# Altium schematic sheet 02_Power.SchDoc
size A4
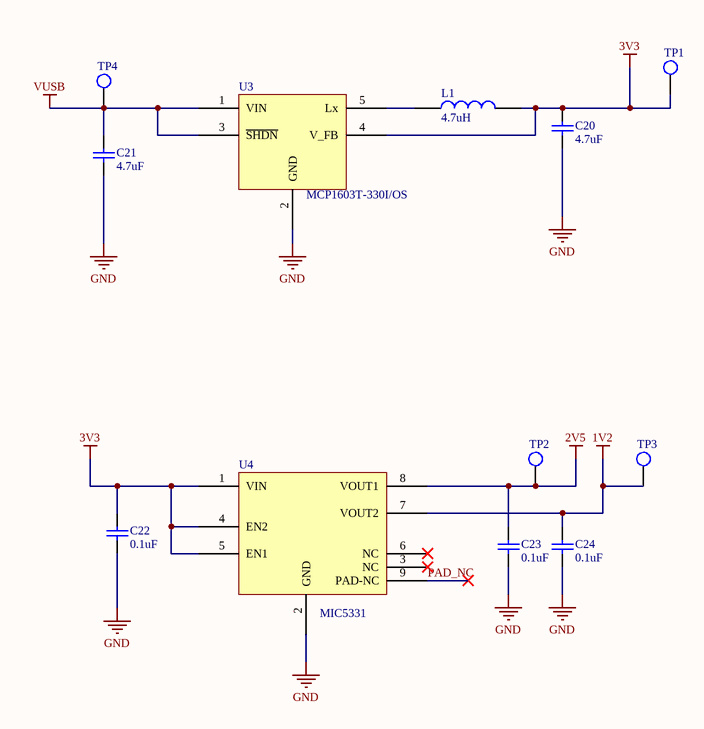
[diagram p0: 02_Power.SchDoc]

## Parts
C20  4.7uF  [CAP0805R]
C21  4.7uF  [CAP0805R]
C22  0.1uF  [CAP0402R]
C23  0.1uF  [CAP0402R]
C24  0.1uF  [CAP0402R]
L1  4.7uH  [744031004]
TP1  TestPoint  [TestPoint]  (value not drawn)  (no BOM)
TP2  TestPoint  [TestPoint]  (value not drawn)  (no BOM)
TP3  TestPoint  [TestPoint]  (value not drawn)  (no BOM)
TP4  TestPoint  [TestPoint]  (value not drawn)  (no BOM)
U3  MCP1603T-330I/OS  [SOT23-5]
U4  MIC5331  [TDFN22]

## Nets
1V2: C24.1 TP3.0(TP) U4.7(VOUT2)
2V5: C23.1 TP2.0(TP) U4.8(VOUT1)
3V3: C20.1 C22.1 L1.2 TP1.0(TP) U3.4(V_FB) U4.1(VIN) U4.4(EN2) U4.5(EN1)
GND: C20.2 C21.2 C22.2 C23.2 C24.2 U3.2(GND) U4.2(GND)
VUSB: C21.1 TP4.0(TP) U3.1(VIN) U3.3(~{SHDN})
PAD_NC: U4.9(PAD-NC)
NetL1_1: L1.1 U3.5(Lx)

Not connected (* = marked no-connect by the designer): U4 3(NC)* 6(NC)*

## Library data of the parts
C20-C24 = C: Capacitor; Class I: Passive; Load: YES; Revision: July-2002: Re-released for DXP Platform.; Supplier 1: Digi-Key; Mount: SMD
  C20 C21: Supplier Part Number 1: 445-14527-2-ND; Value: 4.7uF
  C22-C24: Supplier Part Number 1: 311-3560-1-ND; Value: 0.1uF
L1 = L: Inductor; Load: YES; Supplier 1: Digi-Key; Supplier Part Number 1: 732-1008-1-ND; Value: 4.7uH; Mount: SMD
TP1-TP4 = TestPoint: Test Point; Load: YES
U3 = MCP1603T-330I/OS: 3.3V 500mA Buck Converter; Load: YES; Supplier 1: Digi-Key; Supplier Part Number 1: MCP1603T-330I/OSCT-ND; Published: 12-Mar-2018; Publisher: MUEEC
U4 = MIC5331: 1.2V, 2.5V 300mA LDO; Load: YES; Supplier 1: Digi-Key; Supplier Part Number 1: 576-3150-1-ND; Mount: SMD